# EAGLE design Konekt_Dash_Pro (EAGLE 6.5.0)
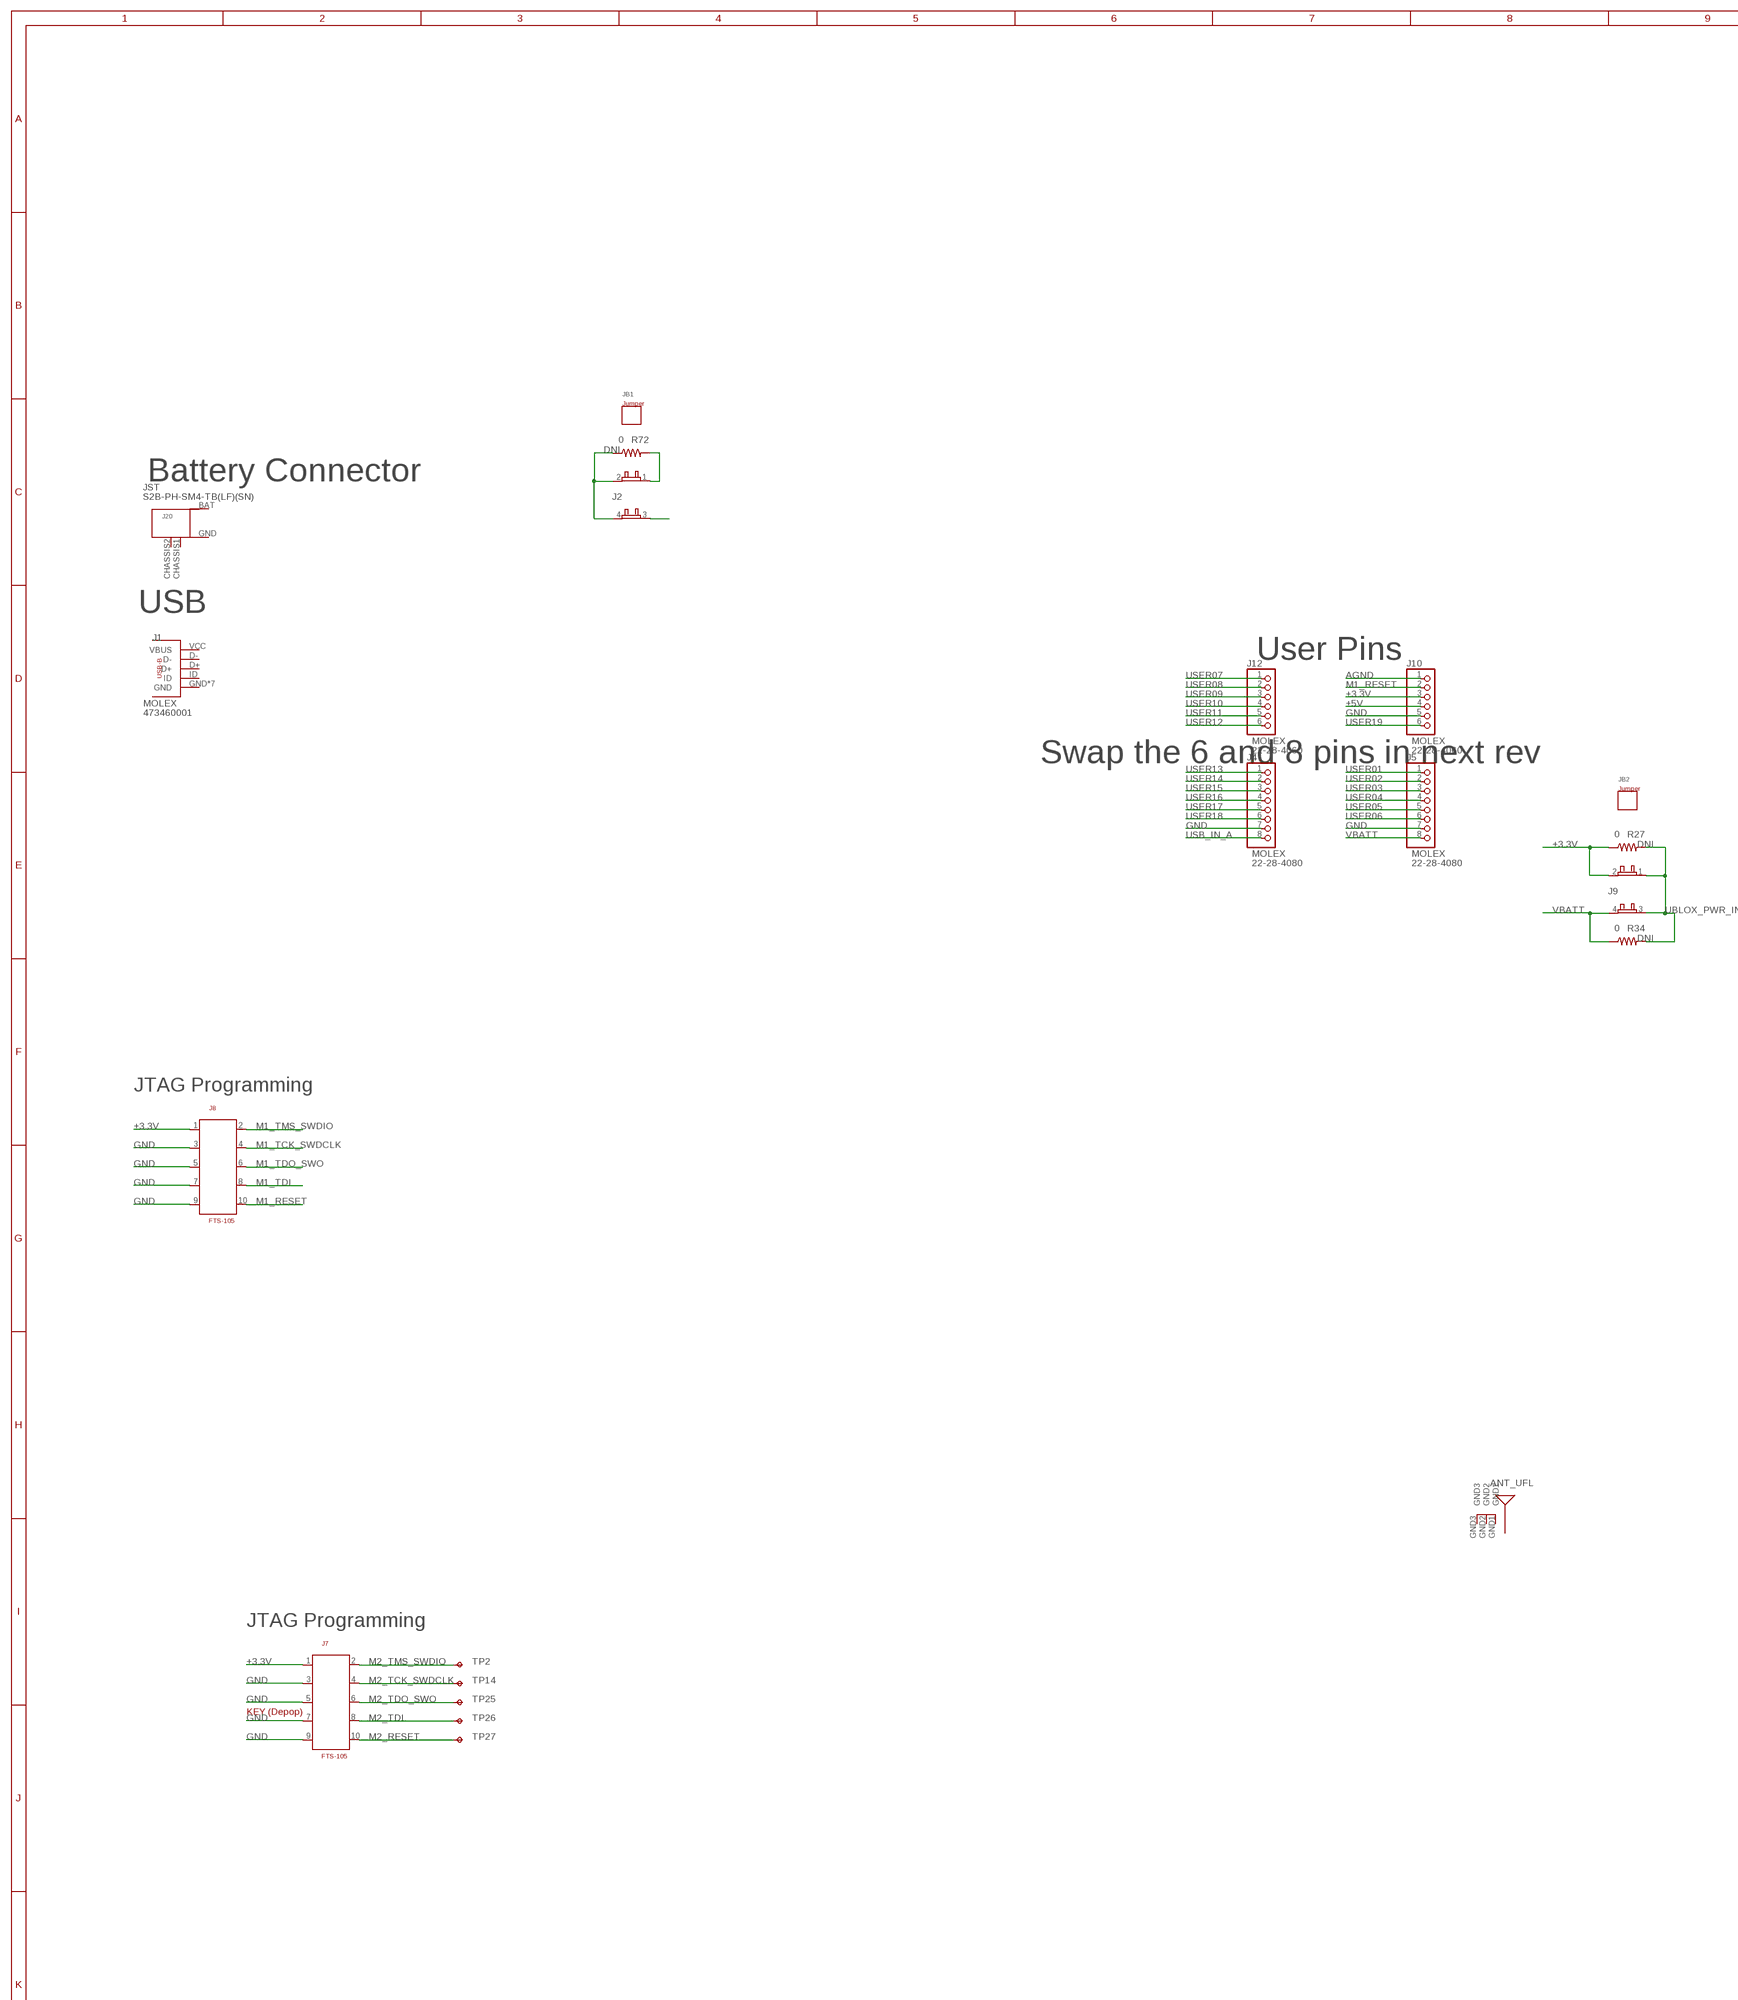
[diagram p0: schematic, sheet 1, part 1 of 3]
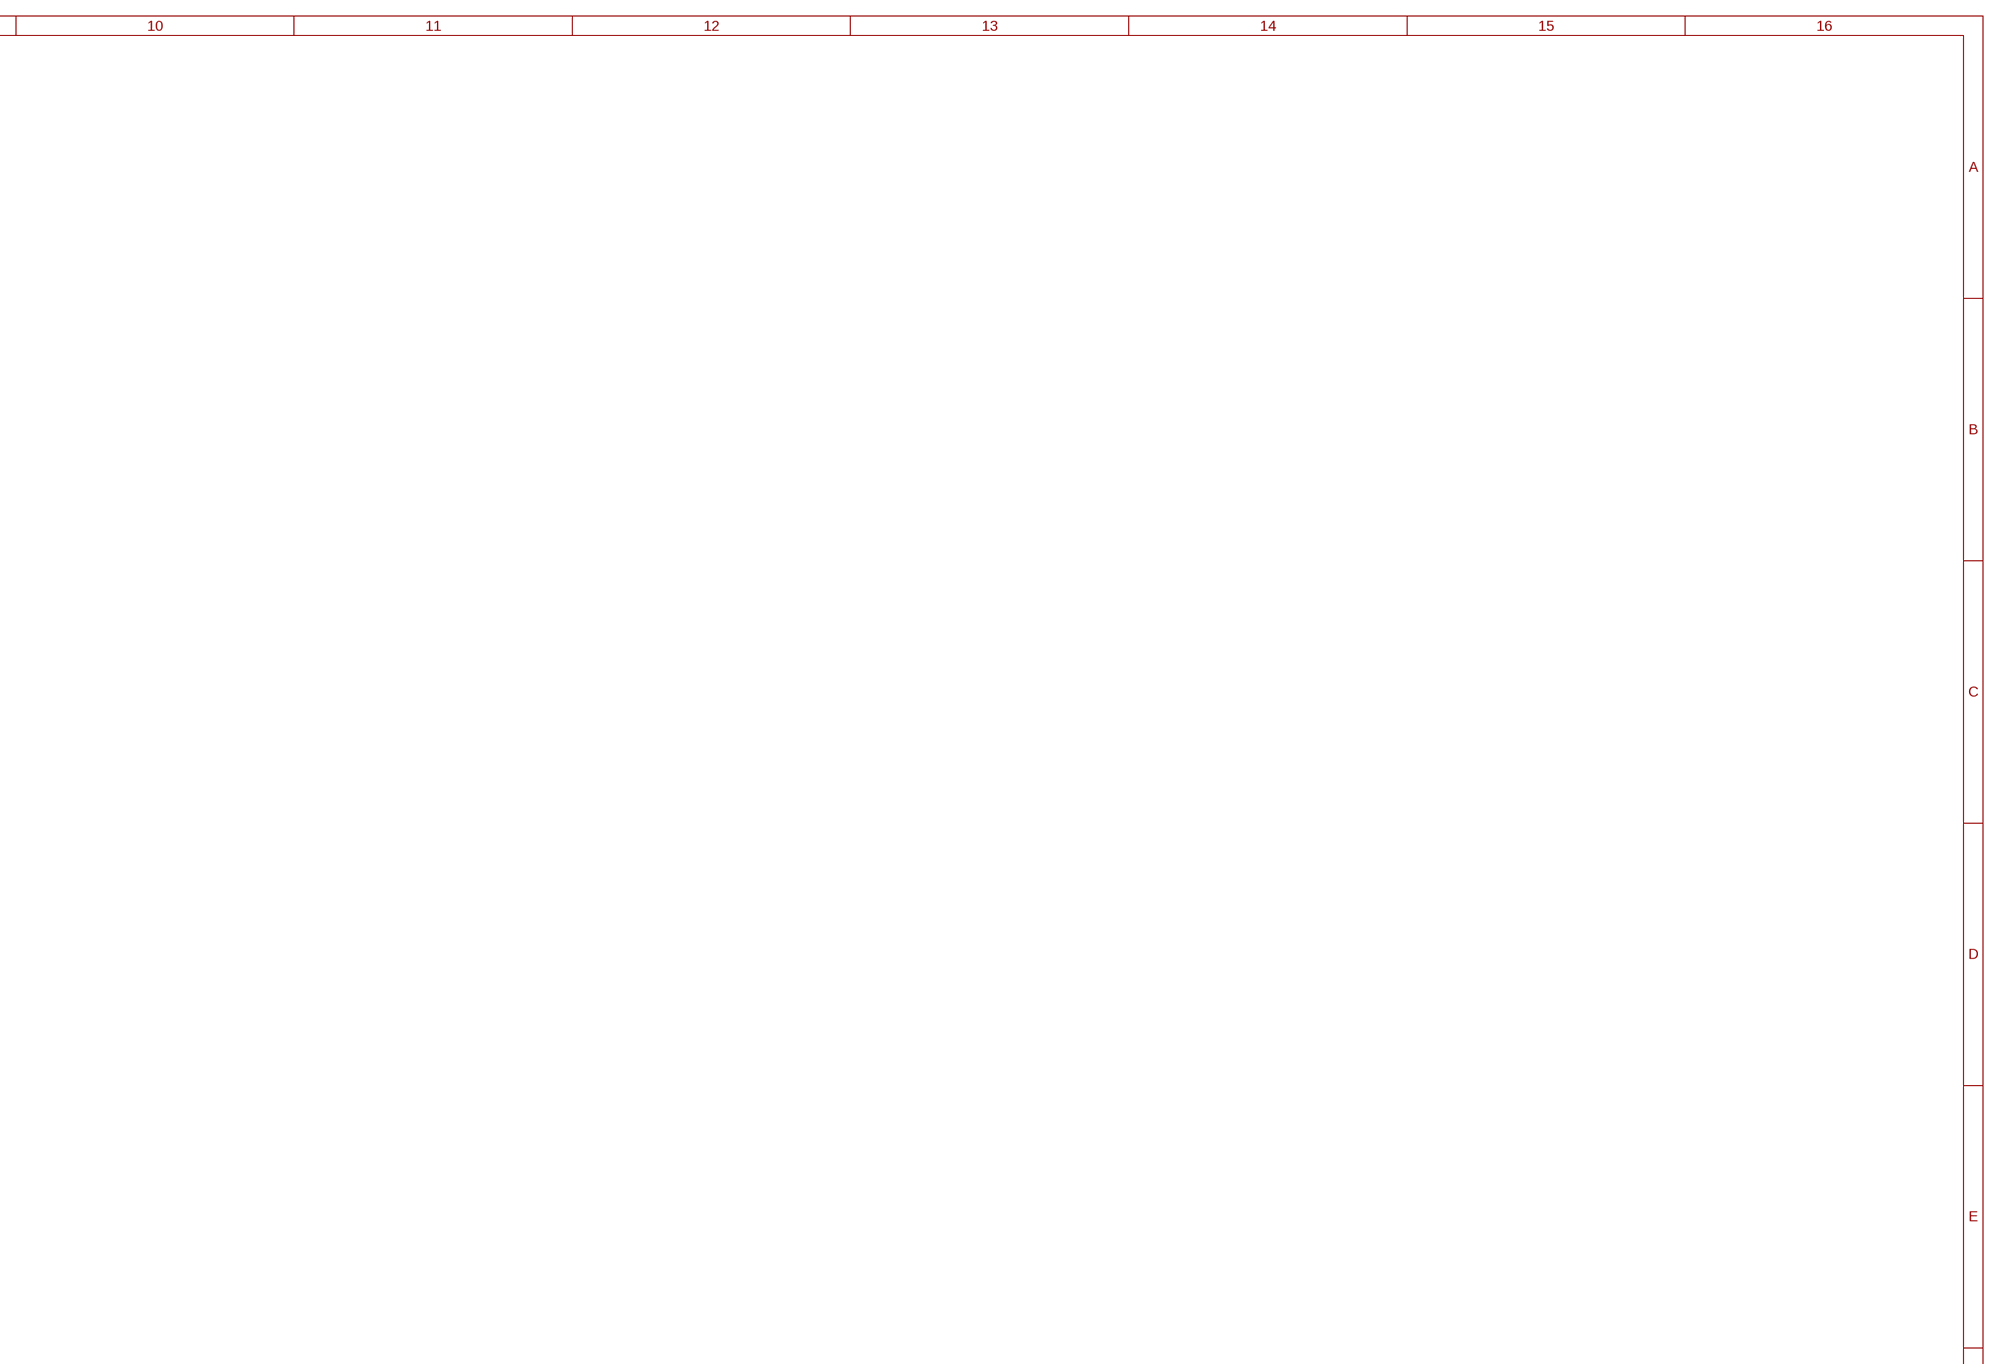
[diagram p1: schematic, sheet 1, part 2 of 3]
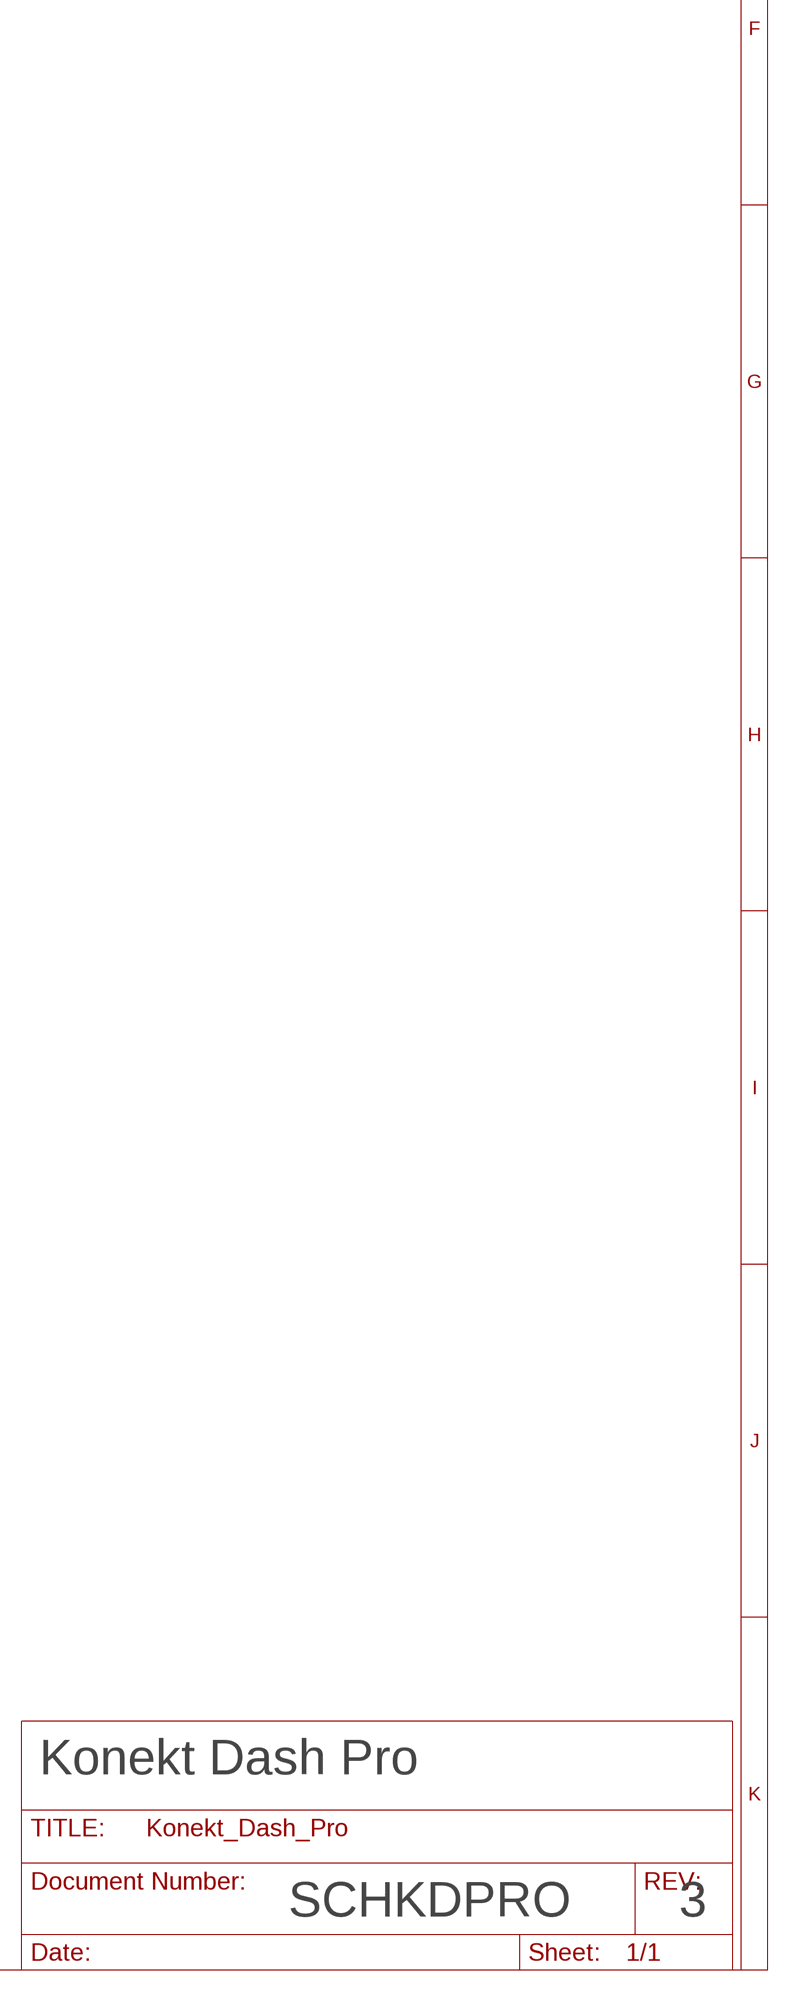
[diagram p2: schematic, sheet 1, part 3 of 3]

## Parts
ANT_UFL  ANT-A-1JB  [UFL]
J1  USB_MICRO_B_MOLEX_473460001  [USB_MICRO_MOLEX_473460001]
J2  CON_JUMPER_1.27_2X2  [FCI_CON_1.27_2X2]
J4  HEADER_0.1_IN_8_POS  [HEADER_0.1_8_POS]
J5  HEADER_0.1_IN_8_POS  [HEADER_0.1_8_POS]
J7  FTS-105  [FTS-105]
J8  FTS-105  [FTS-105]
J9  CON_JUMPER_1.27_2X2  [FCI_CON_1.27_2X2]
J10  PINHD-1X6  [1X06]
J12  PINHD-1X6  [1X06]
J20  BAT_TERM  [JST-PH-2]
JB1  JUMPER_1.27MM  [NOTHING]
JB2  JUMPER_1.27MM  [NOTHING]
R27  0  RESISTOR0402-RES  [0402-RES]
R34  0  RESISTOR0402-RES  [0402-RES]
R72  0  RESISTOR0402-RES  [0402-RES]
TP2  TPTP08R  [TP08R]
TP14  TPTP08R  [TP08R]
TP25  TPTP08R  [TP08R]
TP26  TPTP08R  [TP08R]
TP27  TPTP08R  [TP08R]

## Nets
+3.3V: J7.1 J8.1 J9.2 J10.3 R27.1
+5V: J10.4
AGND: J10.1
GND [gnd]: J4.7 J5.7 J7.3 J7.5 J7.7 J7.9 J8.3 J8.5 J8.7 J8.9 J10.5
M1_RESET: J8.10 J10.2
M1_TCK_SWDCLK: J8.4
M1_TDI: J8.8
M1_TDO_SWO: J8.6
M1_TMS_SWDIO: J8.2
M2_RESET: J7.10 TP27.TP
M2_TCK_SWDCLK: J7.4 TP14.TP
M2_TDI: J7.8 TP26.TP
M2_TDO_SWO: J7.6 TP25.TP
M2_TMS_SWDIO: J7.2 TP2.TP
N$125: J2.1 R72.2
N$127: J2.3
UBLOX_PWR_IN: J9.1 J9.3 R27.2 R34.2
USB_IN [Vbatt]: J2.2 J2.4 R72.1
USB_IN_A: J4.8
USER01 [HIGH_SPEED]: J5.1
USER02 [HIGH_SPEED]: J5.2
USER03 [HIGH_SPEED]: J5.3
USER04 [HIGH_SPEED]: J5.4
USER05 [HIGH_SPEED]: J5.5
USER06 [HIGH_SPEED]: J5.6
USER07 [HIGH_SPEED]: J12.1
USER08 [HIGH_SPEED]: J12.2
USER09 [HIGH_SPEED]: J12.3
USER10 [HIGH_SPEED]: J12.4
USER11 [HIGH_SPEED]: J12.5
USER12 [HIGH_SPEED]: J12.6
USER13 [HIGH_SPEED]: J4.1
USER14 [HIGH_SPEED]: J4.2
USER15 [HIGH_SPEED]: J4.3
USER16 [HIGH_SPEED]: J4.4
USER17 [HIGH_SPEED]: J4.5
USER18 [HIGH_SPEED]: J4.6
USER19 [HIGH_SPEED]: J10.6
VBATT: J5.8 J9.4 R34.1
Unconnected: ANT_UFL.GND1 ANT_UFL.GND2 ANT_UFL.GND3 ANT_UFL.SIGNAL J1.D+ J1.D- J1.GND J1.GND$1(GND) J1.GND$2(GND) J1.GND$3(GND) J1.GND$4(GND) J1.GND$5(GND) J1.GND$6(GND) J1.ID J1.VCC(VBUS) J20.BAT J20.CHASSIS1(CHASSIS_1) J20.CHASSIS2(CHASSIS_2) J20.GND

## Notes on the sheet
- Battery Connector
- USB
- User Pins
- Swap the 6 and 8 pins in next rev
- JTAG Programming
- JTAG Programming
- KEY (Depop)
- Konekt Dash Pro
- SCHKDPRO | 3

## Library data of the parts
ANT_UFL = DDL:ANT-A-1JB; MFG: AMPHENOL; MPN: A-1JB; PACKAGE: UFL; PARTNUM: A-1JB
J1 = konekt:USB_MICRO_B_MOLEX_473460001; MFG: MOLEX; MPN: 473460001; PACKAGE: CUSTOM; PARTNUM: 473460001
J2 J9 = konekt:CON_JUMPER_1.27_2X2; MFG: FCI; MPN: 20021121-00004C4LF; PACKAGE: 1.27_2x2
J4 J5 = konekt:HEADER_0.1_IN_8_POS; MFG: MOLEX; MPN: 22-28-4080; PACKAGE: CUSTOM
J7 J8 = DDL:FTS-105; HEIGHT: 4.32; LENGTH: 6.35; MFG: SAMTEC; MPN: DNI; MPN_DNI: FTS-105-01-F-DV; PACKAGE: FTS-105; PARTNUM: FTS-105-01-F-DV; WIDTH: 3.42
J10 J12 = pinhead:PINHD-1X6: PIN HEADER; MFG: MOLEX; MPN: 22-28-4060; PACKAGE: CUSTOM
J20 = DDL:BAT_TERM; HEIGHT: 4.8; LENGTH: 9.6; MFG: JST; MPN: S2B-PH-SM4-TB(LF)(SN); PACKAGE: JST-2; PARTNUM: S2B-PH-SM4-TB(LF)(SN); WIDTH: 5.8
JB1 JB2 = konekt:JUMPER_1.27MM; MFG: HARWIN; MPN: M50-1920005; PACKAGE: M50
R27 R34 R72 = GeneralLib:RESISTOR: Resistor; DESCRIPTION: Resistor, 1%, 0.125W; MANUFACTURER: Panasonic; MFG: PANASONIC; MPN: DNI; MPN_DNI: ERJ-2GE0R00X
TP2 TP14 TP25-TP27 = testpad:TP: Test pad; MFG: N/A; MPN: N/A

## Net classes
1 power: width 0.406 mm, drill 0.61 mm, clearance 0.152 mm
2 gnd: width 0.203 mm, drill 0.203 mm, clearance 0.152 mm
3 usbvcc: width 0.203 mm, drill 0.61 mm, clearance 0.152 mm
4 aref: width 0.203 mm, drill 0.61 mm, clearance 0.152 mm
5 Vbatt: width 2.5 mm, drill 1 mm, clearance 0.125 mm
6 HIGH_SPEED: width 0.155 mm, drill 0.203 mm, clearance 0.152 mm
7 DIFF_HIGH_SPEED: width 0.157 mm, drill 0.203 mm, clearance 0.152 mm

## Board
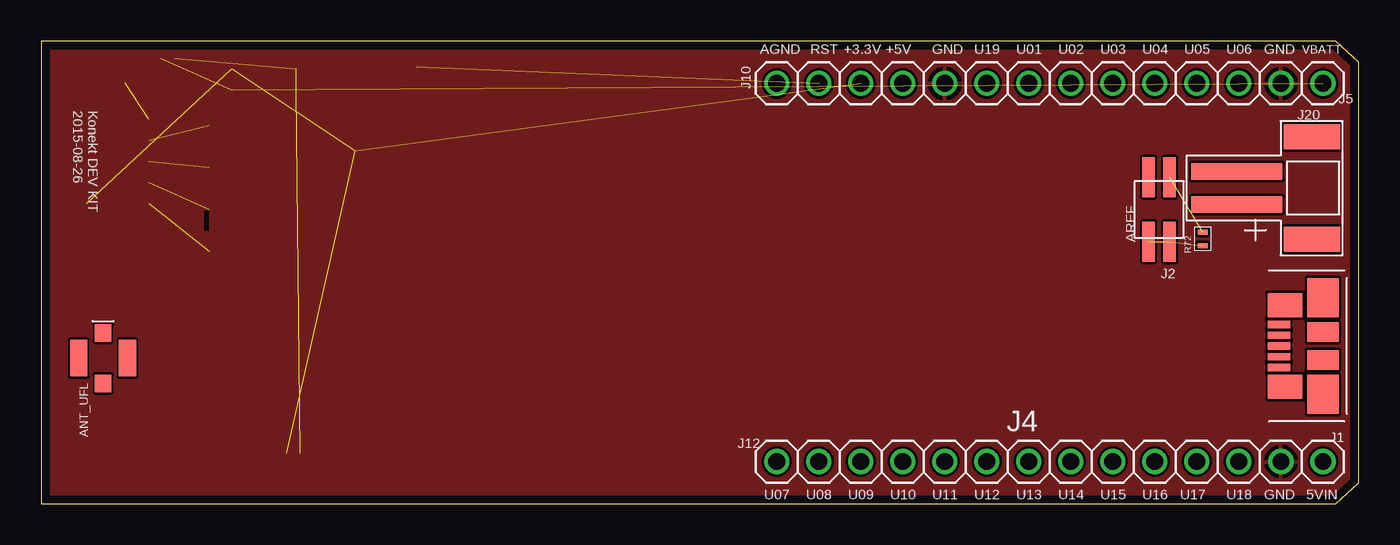
[diagram p3: board, top side]
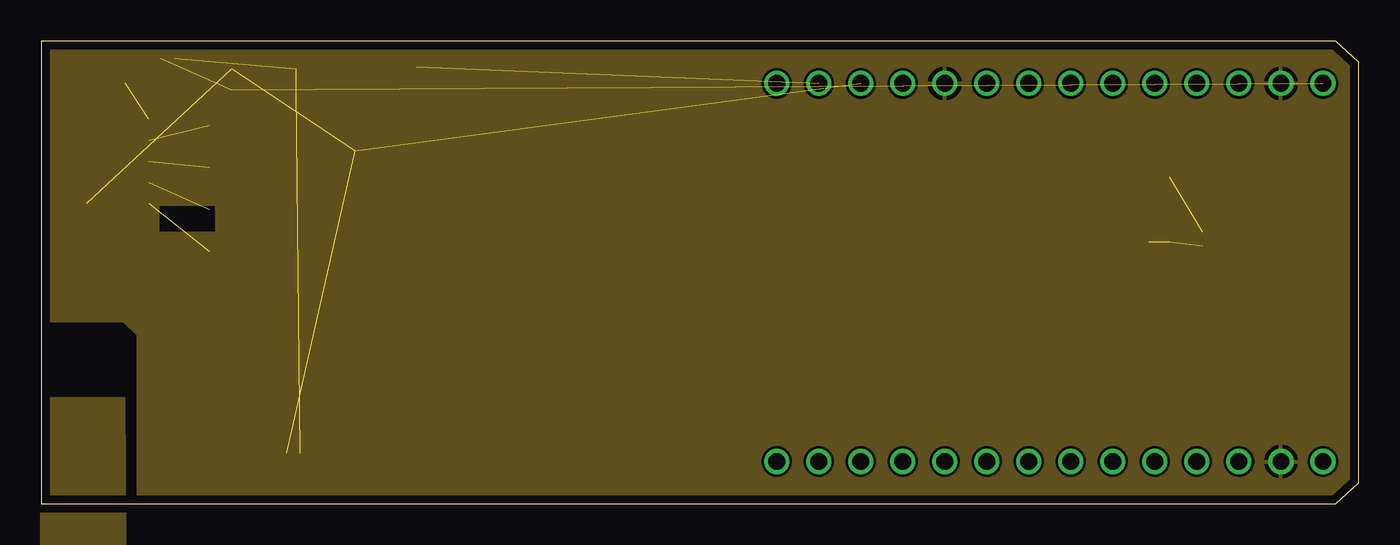
[diagram p4: board, inner layer Route2]
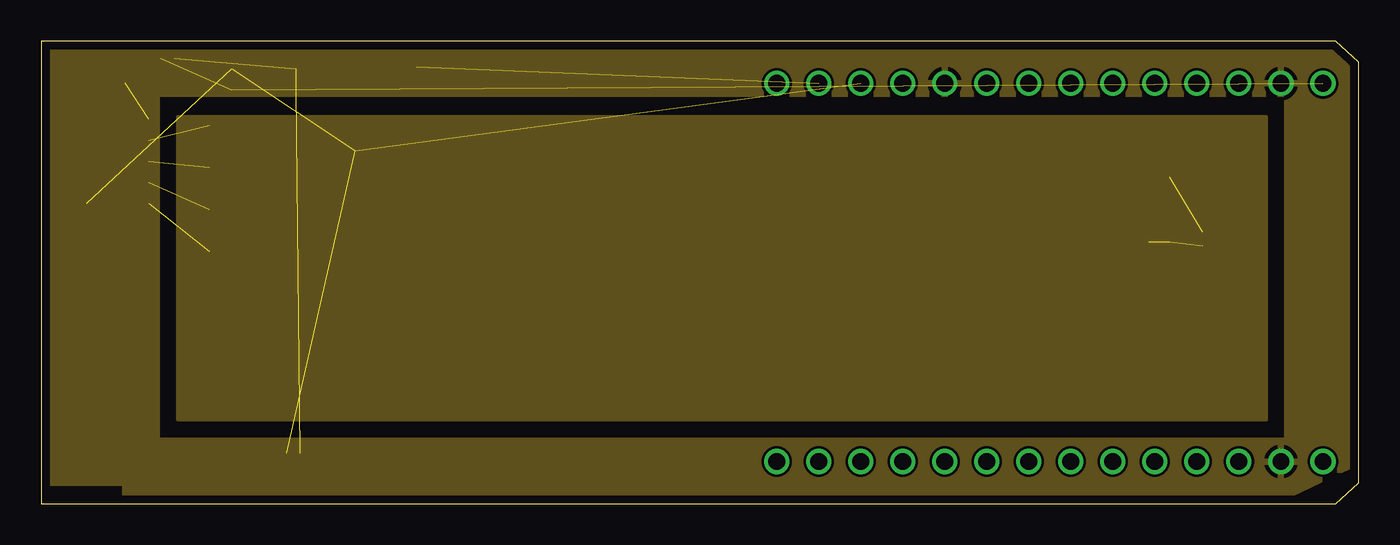
[diagram p5: board, inner layer none]
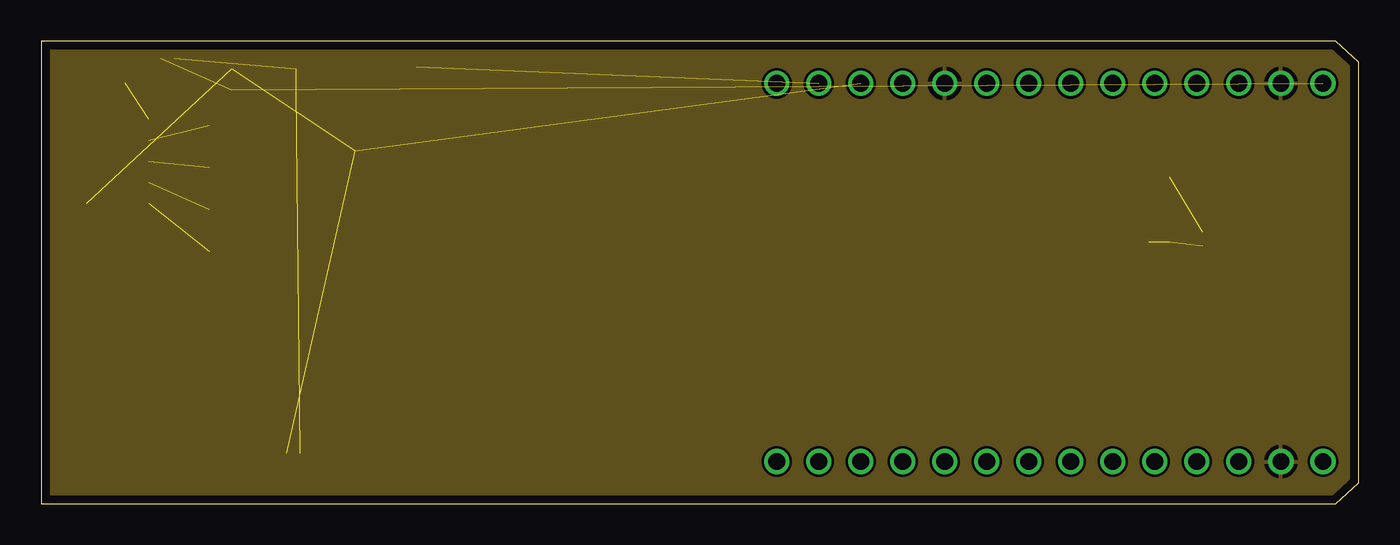
[diagram p6: board, inner layer Route15]
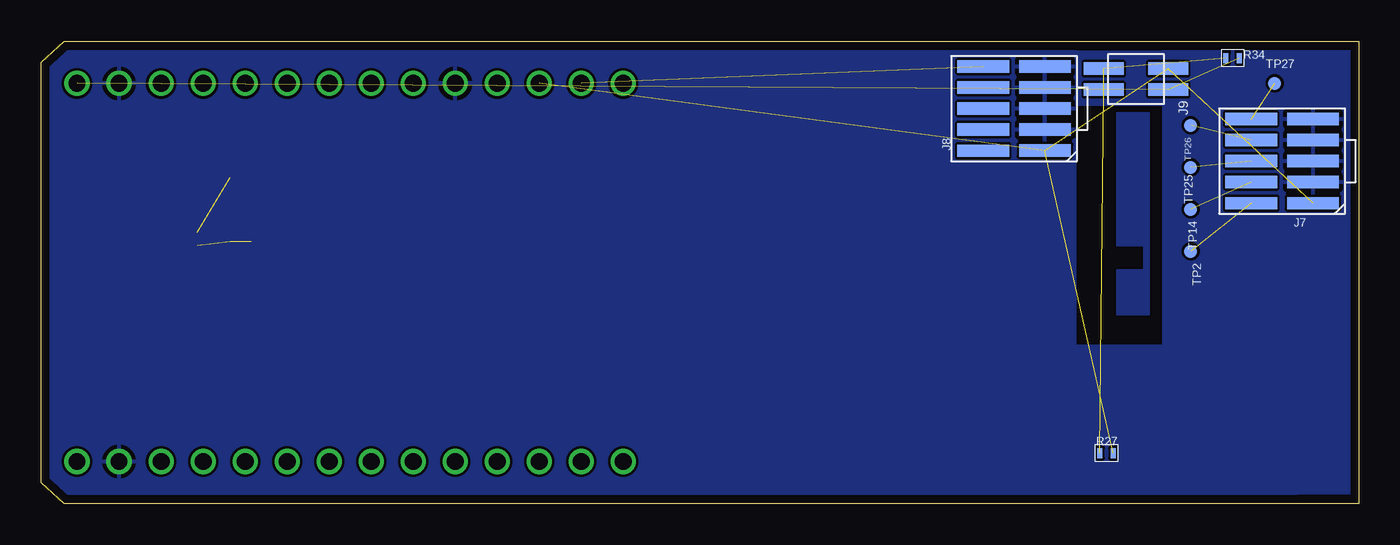
[diagram p7: board, bottom side, seen from below]

Size 79.63 x 27.94 mm. Coordinates in mm from the lower left corner, seen from the top.
Outline: 0,0 78.23,0 79.63,1.27 79.63,26.67 78.23,27.94 0,27.94 0,0
Copper layers (1*2*3*14*15*16): Top 0.01778125mm / dielectric 6.5mil / Route2 0.01778125mm / dielectric 0.5024125mm / none 0.01778125mm / dielectric 6.5mil / Route14 0.01778125mm / dielectric 0.5024125mm / Route15 0.01778125mm / dielectric 6.5mil / Bottom 0.01778125mm
Design rules "default *": minimum track width 6mil, minimum drill 8mil, track to track 6mil, track to pad 6mil, pad to pad 6mil, via to via 6mil, smd to smd 6mil, copper to edge 20mil, drill to drill 8mil, minimum pad ring 10mil, minimum via ring 8mil, stop-mask expansion 4mil, vias tented up to drill 0mil, thermal gap 10mil
tRestrict: area 9.9,16.5 to 10.1,17.7

### Footprints (pad centres in the part's own frame; a part is rotated, then mirrored left to right if it is on the bottom)
UFL = smd 2.2 x 1.05: GND1 0,1.475; GND2 0,-1.475 | smd 1.05 x 1: GND3 -1.525,0; SIGNAL 1.525,0
USB_MICRO_MOLEX_473460001 = smd 1.38 x 0.45: D+ 2.66,0; D- 2.66,0.65; GND 2.66,-1.3; ID 2.66,-0.65; VCC 2.66,1.3 | smd 1.9 x 2.375: GND$1 0,2.913; GND$4 0,-2.913 | smd 1.9 x 1.175: GND$2 0,0.838; GND$3 0,-0.838 | smd 2.1 x 1.475: GND$5 2.3,2.462; GND$6 2.3,-2.462
FCI_CON_1.27_2X2 = smd 0.76 x 2.4: 1 -0.635,-1.95; 2 -0.635,1.95; 3 0.635,-1.95; 4 0.635,1.95
HEADER_0.1_8_POS = drill 1.016: 1 -6.35,0; 2 -3.81,0; 3 -1.27,0; 4 1.27,0; 5 3.81,0; 6 6.35,0; 7 8.89,0; 8 11.43,0
FTS-105 = smd 0.74 x 3.125: 1 -2.54,-1.868; 2 -2.547,1.868; 3 -1.27,-1.868; 4 -1.27,1.868; 5 0,-1.868; 6 0,1.868; 7 1.27,-1.868; 8 1.27,1.868; 9 2.54,-1.868; 10 2.54,1.868
1X06 = drill 1.016: 1 -6.35,0; 2 -3.81,0; 3 -1.27,0; 4 1.27,0; 5 3.81,0; 6 6.35,0
JST-PH-2 = smd 1 x 5.5: BAT 1,-1.75; GND -1,-1.75 | smd 1.5 x 3.4: CHASSIS1 -3.1,2.8; CHASSIS2 3.1,2.8
0402-RES = smd 0.305 x 0.61: 1 -0.406,0; 2 0.406,0
TP08R = smd 0.8 x 0.8: TP 0,0

### Placement (x,y rotation side)
ANT_UFL  3.73,8.79 90 top
J1  77.47,9.53 180 top
J2  67.56,17.78 180 top
J4  66.04,2.54 0 top
J5  66.04,25.4 0 top
J7  4.62,20.7 90 bottom
J8  20.83,23.88 90 bottom
J9  13.46,25.65 270 bottom
J10  50.8,25.4 0 top
J12  50.8,2.54 0 top
J20  74.02,19.08 270 top
JB1  0,0 0 top
JB2  0,0 0 top
R27  15.24,3.05 180 bottom
R34  7.62,26.92 180 bottom
R72  70.21,16 90 top
TP2  10.16,15.24 180 bottom
TP14  10.16,17.78 180 bottom
TP25  10.16,20.32 180 bottom
TP26  10.16,22.86 180 bottom
TP27  5.08,25.4 180 bottom

### Tracks (layer width: path | path; a pad name or v marks a point on that pad's centre or on a via)
+3.3V  (4 unrouted)
  pour none: 74.04,23.37 8.26,23.37 8.26,5.08 74.04,5.08
GND
  pour Top: 0,27.94 0,0 78.23,0 79.63,1.27 79.63,26.67 78.23,27.94
  pour Bottom: 17.14,28.57 17.14,9.53 11.81,9.53 11.81,28.57 0,28.57 0,0.64 78.23,0 79.63,1.27 79.63,26.67 78.23,27.94
  pour Bottom: 10.16,27.3 17.78,27.3 17.78,24.13 10.16,24.13
  pour Route2: 10.62,27.53 10.62,-0.41 73.66,0 79.12,0 79.12,27.94 73.66,27.94
  pour Route15: 0,27.94 0,0 82.17,0 82.42,27.94
  pour none: 5.08,27.94 5.08,24.77 75.31,24.77 75.31,3.81 5.08,3.81 5.08,0 74.3,0 79.63,2.54 79.63,25.4 79.76,25.65 78.49,27.94
  pour none: 0,27.94 0,1.27 6.99,1.27 6.99,27.94
  pour Route2: 10.69,18.06 7.06,18.06 7.06,16.46 7.16,16.36 10.74,16.36 10.74,-0.33 10.69,-0.38 5.11,-0.38 5.84,-0.36 5.82,10.16 5.05,10.92 5.08,27.94 10.52,27.94 10.69,27.76
  pour Route2: 0,11.02 0,27.94 7.62,27.94 7.62,20.32 5.08,20.32 5.08,11.02
  pour Route2: 0,-2.54 -0.08,6.38 5,6.38 5.08,-2.54
M1_RESET  (1 unrouted)
M2_RESET  (1 unrouted)
M2_TCK_SWDCLK  (1 unrouted)
M2_TDI  (1 unrouted)
M2_TDO_SWO  (1 unrouted)
M2_TMS_SWDIO  (1 unrouted)
N$125  (1 unrouted)
UBLOX_PWR_IN  (3 unrouted)
UBLOX_VCC_PRE
  pour Bottom: 12.7,14.61 12.7,11.43 14.61,11.43 14.61,14.1 12.95,14.1 12.95,15.62 14.61,15.62 14.58,23.6 12.67,23.6
USB_IN  (2 unrouted)
VBATT  (2 unrouted)

### Text on the board
tNames: AGND | RST | +3.3V | +5V | GND | U19 | U01 | U02 | U03 | U04 | U05 | U06 | GND | VBATT | Konekt DEV KIT / 2015-08-26 | AREF | U07 | U08 | U09 | U10 | U11 | U12 | U13 | U14 | U15 | U16 | U17 | U18 | GND | 5VIN
Document: 1 | 2 | 3 | 4 | 5 | 6 | A | A | B | B | C | C | Install Jumper on J9, across from two pins closest to Edge of board | Board Material: FR-4 / Net Class: DIFF_PAIR 100 Ohm controlled impedance signified by 6.2 mil traces / Net Class: HIGH_SPEED 50 Ohm controlled impedance signified by 6.1 mil traces / Net Class: ANT 50 Ohm Coplanar Waveguide signified by 10.7 mil traces. / TG Rating TG170 / Finish: ENIG / Lead Free ROHS / All layers 0.5 oz copper / Through Vias only, no blind nor buried vias / Via-in-pad signified by 11.1 mil vias / PCB Color Light Grey " R:233 G:236 B:239 #e9ecef" / Silkscreen in black | Top view of bottom side part. | Top Layer | Layer 2 (GND) | Layer 3 (PWR) | Layer 14 Route | Layer 15 (GND) | Bottom Layer | Install Jumper on J2, across from two pins closest to J20 battery connector. | DWN: | PCBKON-LISA-R4 | DWG DDL | D | D | 2015-08-26 | ALL THROUGH-HOLE CONNECTORS GO ON THE BOTTOM SIDE (Opposite USB connection) | KONEKT IOT CELLULAR GATEWAY | Konekt Data, all rights reserved / Confidential and Proprietary | 1 | 2 | 4 | 5 | 6